# EAGLE design TSOC_USBUART2 (EAGLE 6.6.0)
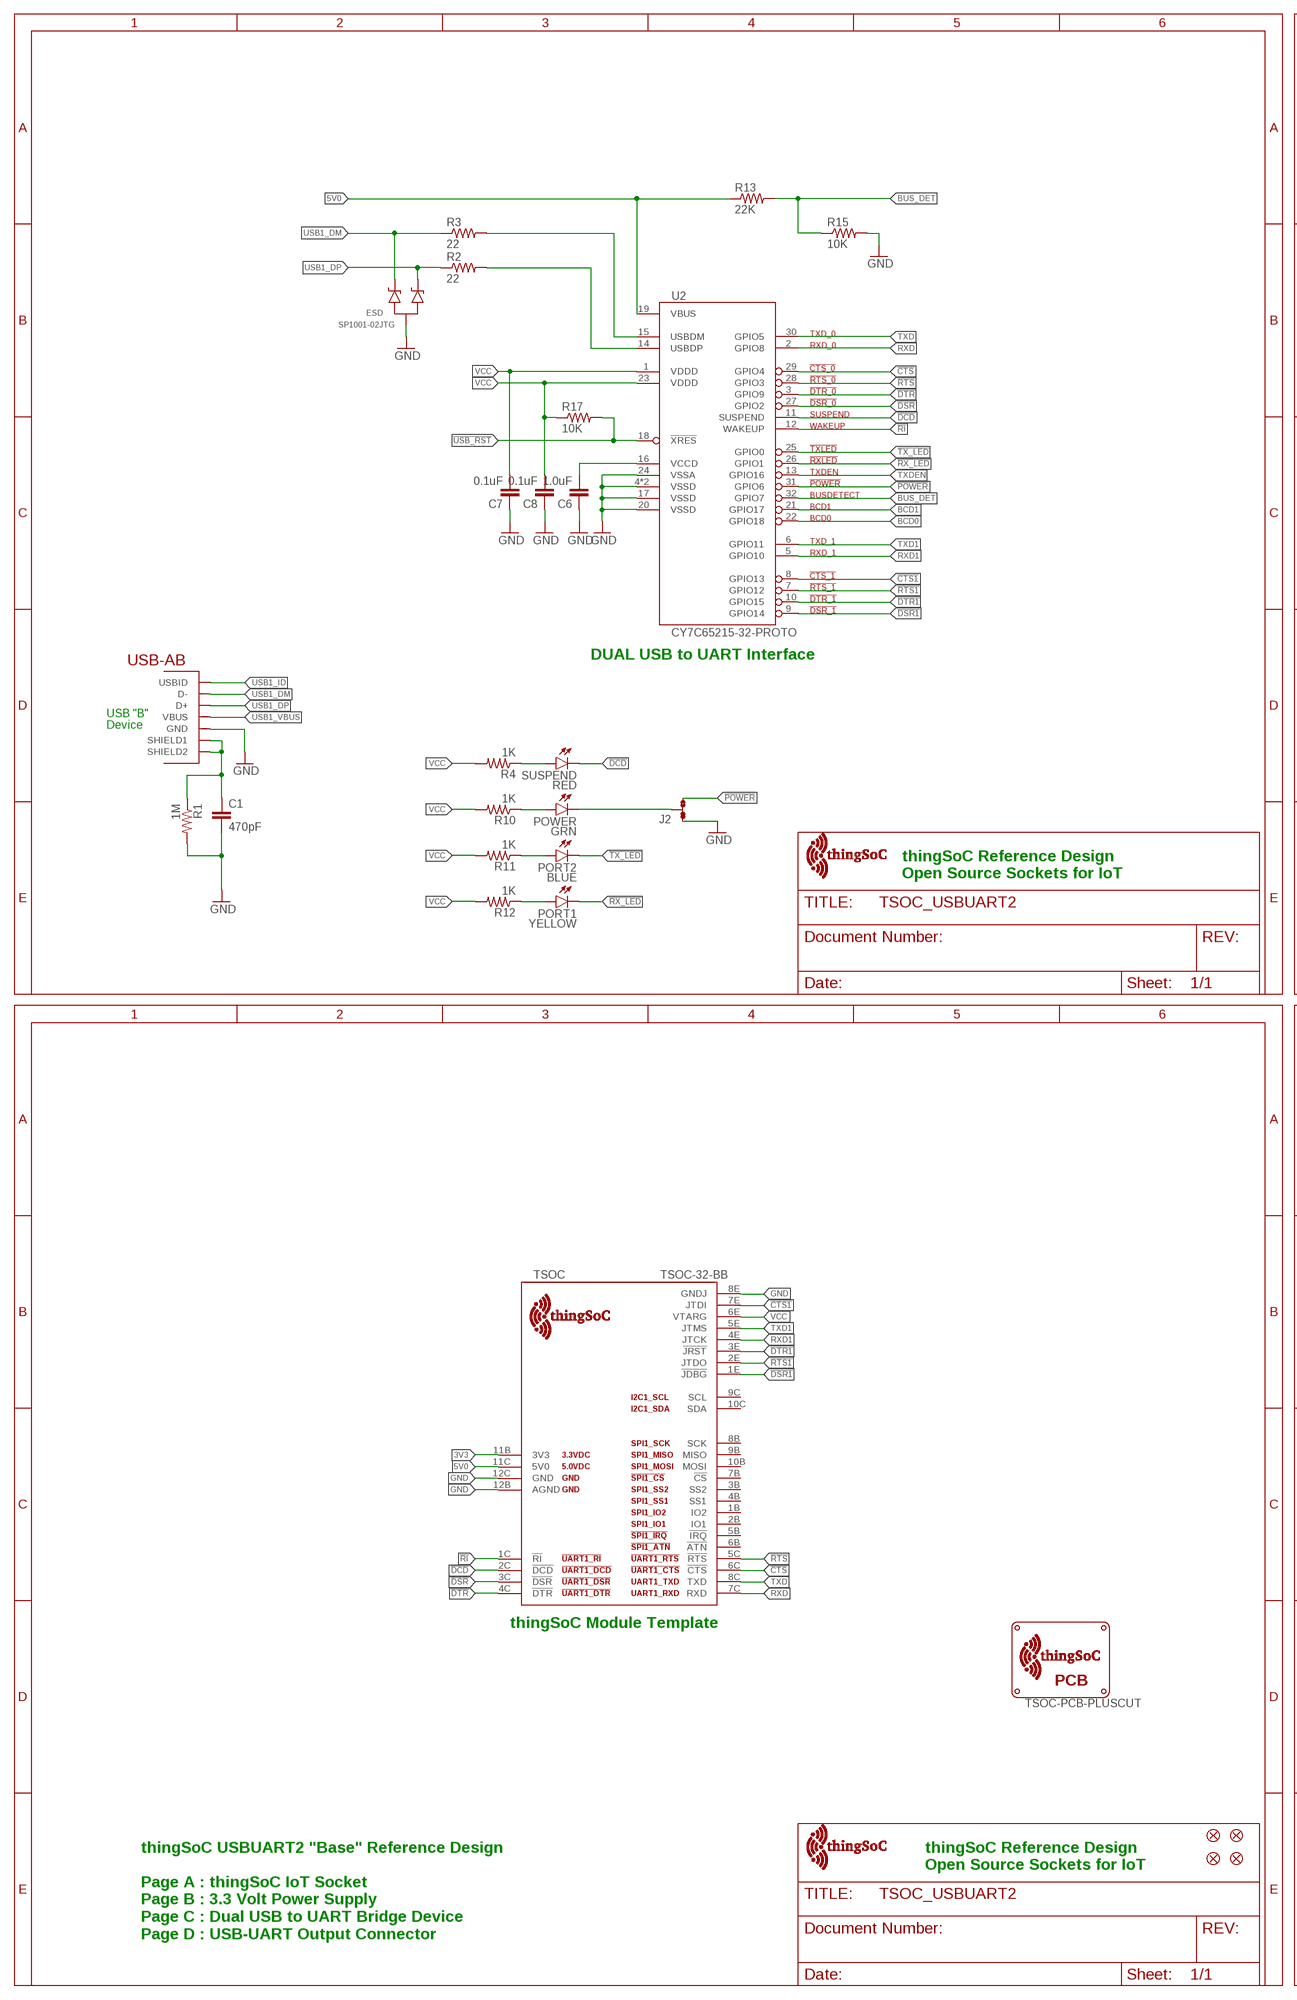
[diagram p0: schematic, sheet 1, part 1 of 2]
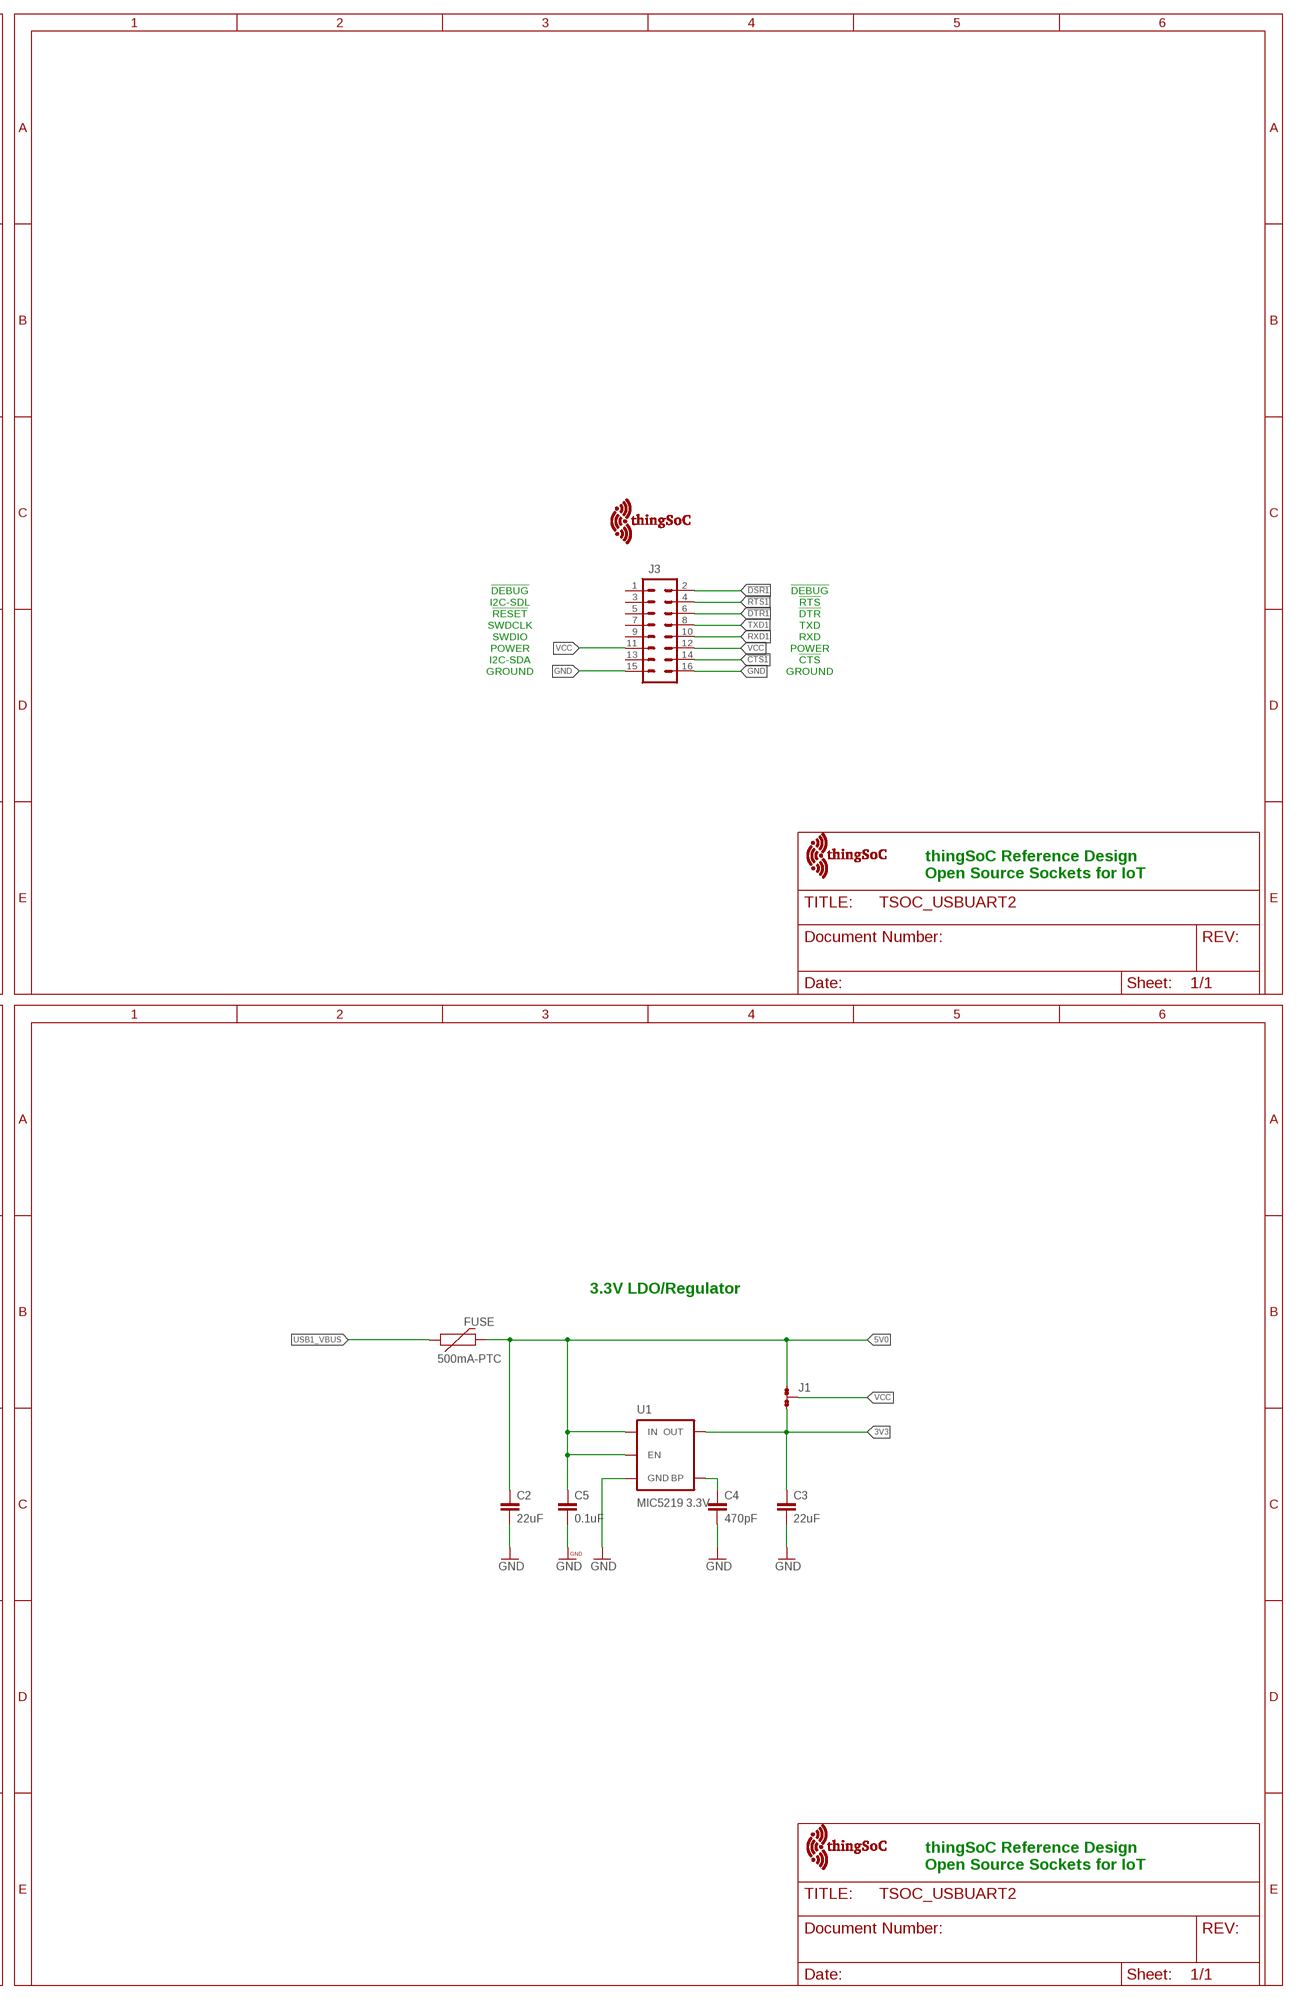
[diagram p1: schematic, sheet 1, part 2 of 2]

## Parts
C1  470pF  CAP-0603  [EIA-0603]
C2  22uF  CAP-1206  [EIA-1206]
C3  22uF  CAP-1206  [EIA-1206]
C4  470pF  CAP-0603  [EIA-0603]
C5  0.1uF  CAP-0603  [EIA-0603]
C6  1.0uF  CAP-0603  [EIA-0603]
C7  0.1uF  CAP-0603  [EIA-0603]
C8  0.1uF  CAP-0603  [EIA-0603]
ESD  SP1001-02JTG  [SC70-3]
FID1  FIDUCIALUFIDUCIAL  [MICRO-FIDUCIAL]
FID2  FIDUCIALUFIDUCIAL  [MICRO-FIDUCIAL]
FID3  FIDUCIALUFIDUCIAL  [MICRO-FIDUCIAL]
FID4  FIDUCIALUFIDUCIAL  [MICRO-FIDUCIAL]
FUSE  500mA-PTC  PTCSMD  [PTC-1206]
J1  JMP-3-1_2  [JMP-3-1_2]
J2  JMP-3-1_2  [JMP-3-1_2]
J3  M08X2  [2X8]
PORT1  YELLOW  LED0603  [LED-0603]
PORT2  BLUE  LED0603  [LED-0603]
POWER  GRN  LED0603  [LED-0603]
R1  1M  RESISTOR-0603  [EIA-0603]
R2  22  RESISTOR-0603  [EIA-0603]
R3  22  RESISTOR-0603  [EIA-0603]
R4  1K  RESISTOR-0603  [EIA-0603]
R10  1K  RESISTOR-0603  [EIA-0603]
R11  1K  RESISTOR-0603  [EIA-0603]
R12  1K  RESISTOR-0603  [EIA-0603]
R13  22K  RESISTOR-0603  [EIA-0603]
R15  10K  RESISTOR-0603  [EIA-0603]
R17  10K  RESISTOR-0603  [EIA-0603]
SUSPEND  RED  LED0603  [LED-0603]
TSOC  TSOC-32-BB  [TSOC-BB-S32]
U1  MIC5219 3.3V  V_REG_MIC52193.3V  [SOT23-5]
U2  CY7C65215-32-PROTO  [QFN32-PROTO]
U$3  TSOC-LOGO-LRG  [TSOC-LOGO-LRG]
U$4  TSOC-LOGO  [TSOC-LOGO-BLANK]
U$5  TSOC-LOGO  [TSOC-LOGO-BLANK]
U$6  TSOC-LOGO  [TSOC-LOGO-BLANK]
U$7  TSOC-PCB-PLUSCUT  [TSOC-BB-BRD-PLUS-CUT]
U$8  TSOC-LOGO-SMALL  [TSOC-LOGO-SML]
USB  USB_AB  [USB-AB-MICRO-SMD]

## Nets
3V3: C3.1 J1.3 TSOC.11B(3V3) U1.5(OUT)
5V0: C2.1 C5.1 FUSE.2 J1.1 R13.1 TSOC.11C(5V0) U1.1(IN) U1.3(EN) U2.19(VBUS)
!CTS: TSOC.6C(!CTS) U2.29(GPIO4)
!CTS1: J3.14 TSOC.7E(JTDI) U2.8(GPIO13)
!DCD: SUSPEND.C TSOC.2C(!DCD) U2.11(SUSPEND)
!DSR: TSOC.3C(!DSR) U2.27(GPIO2)
!DSR1: J3.2 TSOC.1E(!JDBG) U2.9(GPIO14)
!DTR: TSOC.4C(!DTR) U2.3(GPIO9)
!DTR1: J3.6 TSOC.3E(!JRST) U2.10(GPIO15)
!POWER: J2.3 U2.31(GPIO6)
!RI: TSOC.1C(!RI) U2.12(WAKEUP)
!RTS: TSOC.5C(!RTS) U2.28(GPIO3)
!RTS1: J3.4 TSOC.2E(JTDO) U2.7(GPIO12)
!RX_LED: PORT1.C U2.26(GPIO1)
!TX_LED: PORT2.C U2.25(GPIO0)
!USB_RST: R17.2 U2.18(!XRES)
BCD0: U2.22(GPIO18)
BCD1: U2.21(GPIO17)
BLU: PORT2.A R11.1
BUS_DET: R13.2 R15.1 U2.32(GPIO7)
BYPASS1: C4.1 U1.4(BP)
GND [vcc]: C1.2 C2.2 C3.2 C4.2 C5.2 C6.1 C7.1 C8.1 ESD.3(A) J2.1 J3.15 J3.16 R1.2 R15.2 TSOC.8E(GNDJ) TSOC.12B(AGND) TSOC.12C(GND) U1.2(GND) U2.4(VSSD) U2.17(VSSD) U2.20(VSSD) U2.24(VSSA) U2.EXP(VSSD) USB.GND
GRN: POWER.A R10.1
PWR: J2.2 POWER.C
RED: R4.1 SUSPEND.A
RXD: TSOC.7C(RXD) U2.2(GPIO8)
RXD1: J3.10 TSOC.4E(JTCK) U2.5(GPIO10)
TXD: TSOC.8C(TXD) U2.30(GPIO5)
TXD1: J3.8 TSOC.5E(JTMS) U2.6(GPIO11)
TXDEN: U2.13(GPIO16)
USB1_DM: ESD.2(C2) R3.1 USB.D-
USB1_DP: ESD.1(C1) R2.1 USB.D+
USB1_ID: USB.ID(USBID)
USB1_M: R3.2 U2.15(USBDM)
USB1_P: R2.2 U2.14(USBDP)
USB1_SHIELD: C1.1 R1.1 USB.SHIELD1 USB.SHIELD2
USB1_VBUS: FUSE.1 USB.VBUS
VCC: C7.2 C8.2 J1.2 J3.11 J3.12 R4.2 R10.2 R11.2 R12.2 R17.1 TSOC.6E(VTARG) U2.1(VDDD) U2.23(VDDD)
VCCD1: C6.2 U2.16(VCCD)
YEL: PORT1.A R12.1
Unconnected: J3.1 J3.3 J3.5 J3.7 J3.9 J3.13 TSOC.1B(IO2) TSOC.2B(IO1) TSOC.3B(SS2) TSOC.4B(SS1) TSOC.5B(!IRQ) TSOC.6B(!ATN) TSOC.7B(!CS) TSOC.8B(SCK) TSOC.9B(MISO) TSOC.9C(SCL) TSOC.10B(MOSI) TSOC.10C(SDA)

## Notes on the sheet
- !DEBUG | !DEBUG
- I2C-SDL | !RTS
- !RESET | !DTR
- SWDCLK | TXD
- SWDIO | RXD
- POWER | POWER
- DUAL USB to UART Interface | I2C-SDA | !CTS
- GROUND | GROUND
- USB "B"
- Device
- thingSoC Reference Design
  Open Source Sockets for IoT
- thingSoC Reference Design
  Open Source Sockets for IoT
- 3.3V LDO/Regulator
- thingSoC Module Template
- thingSoC Reference Design
  Open Source Sockets for IoT
- thingSoC Reference Design
  Open Source Sockets for IoT
- thingSoC USBUART2 "Base" Reference Design
  
  Page A : thingSoC IoT Socket
  Page B : 3.3 Volt Power Supply
  Page C : Dual USB to UART Bridge Device
  Page D : USB-UART Output Connector

## Library data of the parts
C1-C8 = TSOC_USBUART2:CAP: Ceramic Capacitor SMD
ESD = TSOC-ESP8266-BASE:SP1001-02JTG: Littelfuse SP1001-02JTG TVS Diode Array 8pf 15kV Source: http://www.littelfuse.com/data/en/Product_Catalogs/Littelfuse_TVS_Diode_Array_SPA_Catalog.pdf patternshed.com: created 3/25/2012
FID1-FID4 = TSOC-ESP8266-BASE:FIDUCIAL: Fiducial Alignment Points Various fiducial points for machine vision alignment.
FUSE = SparkFun:PTC: Resettable Fuse PTC Resettable Fuse. Spark Fun Electronics SKU : COM-08357
J1 J2 = PatternAgents-ProtoPads:JMP-3-1_2: Three Terminal Jumper - 1 & 2 Connected Positions 1and 2 are normally connected. PatternAgents ProtoPads Library Schematic and PCB layout libraries for design patterns by PatternAgents. For the CADSoft Eagle CAD program : http://www.cadsoftusa.com/download-eagle/ Source LBR : http://www.patternagents.com Github : https://github.com/PatternAgents License : http://creativecommons.org/licenses/by-sa/4.0/ (Creative Commons 4.0) THIS SOFTWARE IS PROVIDED BY THE CONTRIBUTORS "AS IS" AND WITHOUT ANY EXPRESS OR IMPLIED WARRANTIES, INCLUDING, BUT NOT LIMITED TO, THE IMPLIED WARRANTIES OF MERCHANTABILITY AND FITNESS FOR A PARTICULAR PURPOSE ARE DISCLAIMED. IN NO EVENT SHALL THE COPYRIGHT OWNER OR CONTRIBUTORS BE LIABLE FOR ANY DIRECT, INDIRECT, INCIDENTAL, SPECIAL, EXEMPLARY, OR CONSEQUENTIAL DAMAGES (INCLUDING, BUT NOT LIMITED TO, PROCUREMENT OF SUBSTITUTE GOODS OR SERVICES; LOSS OF USE, DATA, OR PROFITS; OR BUSINESS INTERRUPTION) HOWEVER CAUSED AND ON ANY THEORY OF LIABILITY, WHETHER IN CONTRACT, STRICT LIABILITY, OR TORT (INCLUDING NEGLIGENCE OR OTHERWISE) ARISING IN ANY WAY OUT OF THE USE OF THIS SOFTWARE, EVEN IF ADVISED OF THE POSSIBILITY OF SUCH DAMAGE.; BOM: EXCLUDE
J3 = PatternAgents-ProtoPads:M08X2: .1" headers, two rows of 8 each
PORT1 PORT2 POWER SUSPEND = TSOC-ESP8266-BASE:LED: LEDs Standard schematic elements and footprints for 5mm, 3mm, 1206, and 0603 sized LEDs. 5mm - Spark Fun Electronics SKU : COM-00529 (and others)
R1-R4 R10-R13 R15 R17 = TSOC_USBUART2:RESISTOR
TSOC = thingSoC:TSOC-32: thingSoC Thirty-Two (32) Pin Socket Source LBR : http://www.thingsoc.com Github : https://github.com/thingsoc License : http://creativecommons.org/licenses/by-sa/4.0/ (Creative Commons 4.0) THIS SOFTWARE IS PROVIDED BY THE CONTRIBUTORS "AS IS" AND WITHOUT ANY EXPRESS OR IMPLIED WARRANTIES, INCLUDING, BUT NOT LIMITED TO, THE IMPLIED WARRANTIES OF MERCHANTABILITY AND FITNESS FOR A PARTICULAR PURPOSE ARE DISCLAIMED. IN NO EVENT SHALL THE COPYRIGHT OWNER OR CONTRIBUTORS BE LIABLE FOR ANY DIRECT, INDIRECT, INCIDENTAL, SPECIAL, EXEMPLARY, OR CONSEQUENTIAL DAMAGES (INCLUDING, BUT NOT LIMITED TO, PROCUREMENT OF SUBSTITUTE GOODS OR SERVICES; LOSS OF USE, DATA, OR PROFITS; OR BUSINESS INTERRUPTION) HOWEVER CAUSED AND ON ANY THEORY OF LIABILITY, WHETHER IN CONTRACT, STRICT LIABILITY, OR TORT (INCLUDING NEGLIGENCE OR OTHERWISE) ARISING IN ANY WAY OUT OF THE USE OF THIS SOFTWARE, EVEN IF ADVISED OF THE POSSIBILITY OF SUCH DAMAGE.
U1 = TSOC-ESP8266-BASE:V_REG_MIC5219: V_REG MIC5219 Standard 3.3V and 5V 500mA LDO voltage regulator in SOT-23 layout. Micrel part MIC5219. BP (by-pass) pin is used to lower output noise with 470pF cap, may be left open.; PROD_ID: VREG-09872
U2 = PatternAgents-Cypress:CY7C65215-32: Cypress EZ-USB ® CY7C65215-32QFN DUAL CHANNEL USB TO UART/SPI/IC Bridge Full-Speed USB Peripheral Controller Source Data: http://www.cypress.com/?mpn=CY7C65211-24QFN LBR Source: http://www.patternagents.com THIS SOFTWARE IS PROVIDED BY THE CONTRIBUTORS "AS IS" AND WITHOUT ANY EXPRESS OR IMPLIED WARRANTIES, INCLUDING, BUT NOT LIMITED TO, THE IMPLIED WARRANTIES OF MERCHANTABILITY AND FITNESS FOR A PARTICULAR PURPOSE ARE DISCLAIMED. IN NO EVENT SHALL THE COPYRIGHT OWNER OR CONTRIBUTORS BE LIABLE FOR ANY DIRECT, INDIRECT, INCIDENTAL, SPECIAL, EXEMPLARY, OR CONSEQUENTIAL DAMAGES (INCLUDING, BUT NOT LIMITED TO, PROCUREMENT OF SUBSTITUTE GOODS OR SERVICES; LOSS OF USE, DATA, OR PROFITS; OR BUSINESS INTERRUPTION) HOWEVER CAUSED AND ON ANY THEORY OF LIABILITY, WHETHER IN CONTRACT, STRICT LIABILITY, OR TORT (INCLUDING NEGLIGENCE OR OTHERWISE) ARISING IN ANY WAY OUT OF THE USE OF THIS SOFTWARE, EVEN IF ADVISED OF THE POSSIBILITY OF SUCH DAMAGE.
U$3-U$6 U$8 = thingSoC:TSOC-LOGO: thingSoC Logo Source LBR : http://www.thingsoc.com Github : https://github.com/thingsoc License : http://creativecommons.org/licenses/by-sa/4.0/ (Creative Commons 4.0) THIS SOFTWARE IS PROVIDED BY THE CONTRIBUTORS "AS IS" AND WITHOUT ANY EXPRESS OR IMPLIED WARRANTIES, INCLUDING, BUT NOT LIMITED TO, THE IMPLIED WARRANTIES OF MERCHANTABILITY AND FITNESS FOR A PARTICULAR PURPOSE ARE DISCLAIMED. IN NO EVENT SHALL THE COPYRIGHT OWNER OR CONTRIBUTORS BE LIABLE FOR ANY DIRECT, INDIRECT, INCIDENTAL, SPECIAL, EXEMPLARY, OR CONSEQUENTIAL DAMAGES (INCLUDING, BUT NOT LIMITED TO, PROCUREMENT OF SUBSTITUTE GOODS OR SERVICES; LOSS OF USE, DATA, OR PROFITS; OR BUSINESS INTERRUPTION) HOWEVER CAUSED AND ON ANY THEORY OF LIABILITY, WHETHER IN CONTRACT, STRICT LIABILITY, OR TORT (INCLUDING NEGLIGENCE OR OTHERWISE) ARISING IN ANY WAY OUT OF THE USE OF THIS SOFTWARE, EVEN IF ADVISED OF THE POSSIBILITY OF SUCH DAMAGE.
U$7 = thingSoC:TSOC-PCB: thingSoC PCB Outlines Boards Outlines for Standard Sizes (in the DImension Layer) (Registration marks in the tDocu layer - make sure to turn on tDocu/bDocu) Source LBR : http://www.thingsoc.com Github : https://github.com/thingsoc License : http://creativecommons.org/licenses/by-sa/4.0/ (Creative Commons 4.0) THIS SOFTWARE IS PROVIDED BY THE CONTRIBUTORS "AS IS" AND WITHOUT ANY EXPRESS OR IMPLIED WARRANTIES, INCLUDING, BUT NOT LIMITED TO, THE IMPLIED WARRANTIES OF MERCHANTABILITY AND FITNESS FOR A PARTICULAR PURPOSE ARE DISCLAIMED. IN NO EVENT SHALL THE COPYRIGHT OWNER OR CONTRIBUTORS BE LIABLE FOR ANY DIRECT, INDIRECT, INCIDENTAL, SPECIAL, EXEMPLARY, OR CONSEQUENTIAL DAMAGES (INCLUDING, BUT NOT LIMITED TO, PROCUREMENT OF SUBSTITUTE GOODS OR SERVICES; LOSS OF USE, DATA, OR PROFITS; OR BUSINESS INTERRUPTION) HOWEVER CAUSED AND ON ANY THEORY OF LIABILITY, WHETHER IN CONTRACT, STRICT LIABILITY, OR TORT (INCLUDING NEGLIGENCE OR OTHERWISE) ARISING IN ANY WAY OUT OF THE USE OF THIS SOFTWARE, EVEN IF ADVISED OF THE POSSIBILITY OF SUCH DAMAGE.
USB = BeeSafe:USB_AB: This is a USB AB connector that is compatible with USB OTG. i.e. this connector can serve as a host or device

## Net classes
1 vcc: width 0.254 mm

## Board
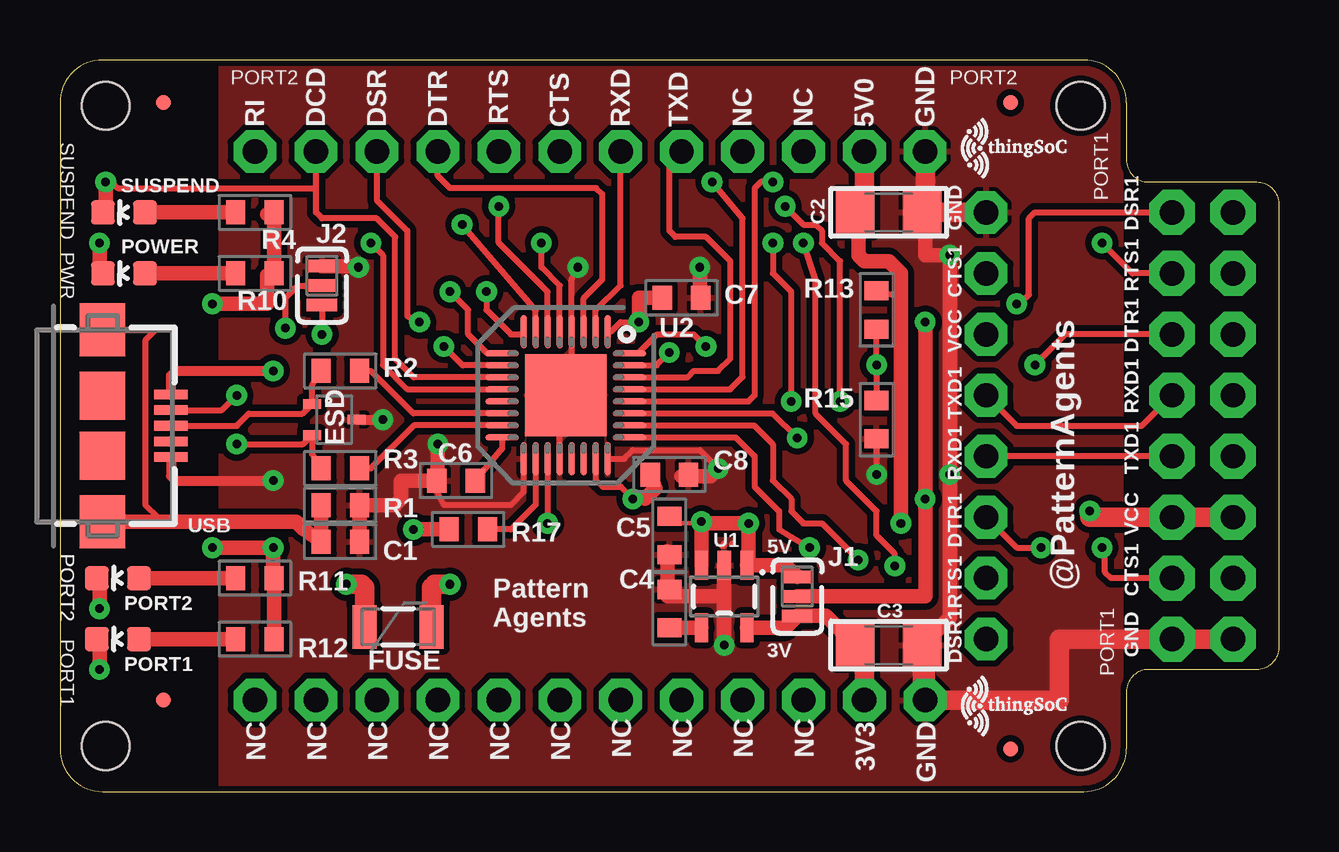
[diagram p2: board, top side]
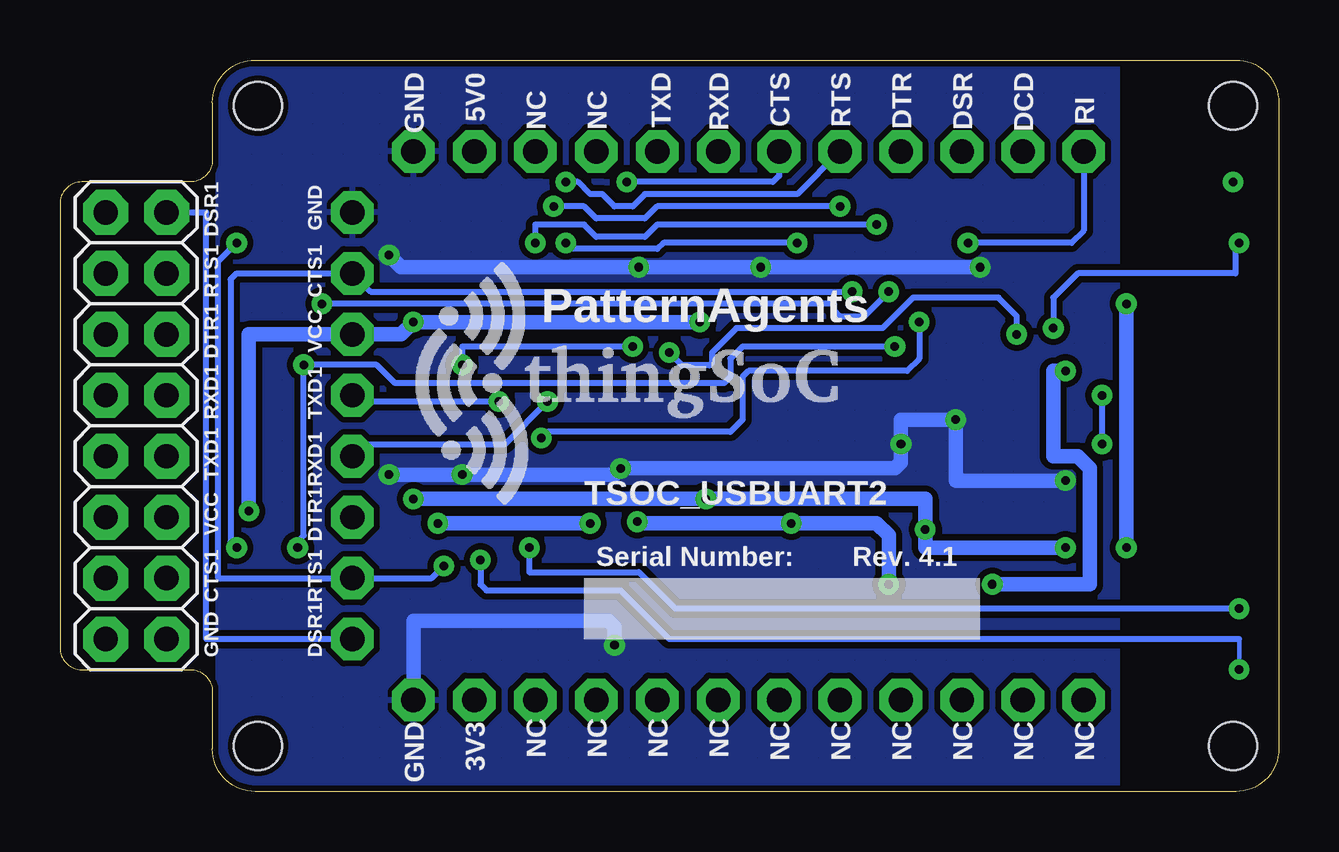
[diagram p3: board, bottom side, seen from below]

Size 50.8 x 30.48 mm. Coordinates in mm from the lower left corner, seen from the top.
Copper layers (1*16): Top 0.035mm / dielectric 1.5mm / Bottom 0.035mm
Design rules "PatternAgents_7mil": minimum track width 7mil, minimum drill 14mil, track to track 7mil, track to pad 7mil, pad to pad 7mil, via to via 7mil, smd to smd 7mil, copper to edge 7mil, drill to drill 7mil, minimum pad ring 12mil, minimum via ring 10mil, stop-mask expansion 4mil, vias tented up to drill 25mil, thermal gap 7mil

### Footprints (pad centres in the part's own frame; a part is rotated, then mirrored left to right if it is on the bottom)
EIA-0603 = smd 0.8 x 1: 1 -0.8,0; 2 0.8,0
EIA-1206 = smd 1.6 x 1.8: 1 -1.4,0; 2 1.4,0
SC70-3 = smd 0.4 x 0.75: 1 -0.65,-0.925; 2 0.65,-0.925; 3 0,0.925
MICRO-FIDUCIAL = smd 0.635 x 0.635: 1 0,0
PTC-1206 = smd 1 x 1.8: 1 -1.4,0; 2 1.4,0
JMP-3-1_2 = smd 0.508 x 1.27: 1 -0.813,0; 2 0,0; 3 0.813,0
2X8 = drill 1.016 pad 1.88 octagon: 1 0,0; 2 0,2.54; 3 2.54,0; 4 2.54,2.54; 5 5.08,0; 6 5.08,2.54; 7 7.62,0; 8 7.62,2.54; 9 10.16,0; 10 10.16,2.54; 11 12.7,0; 12 12.7,2.54; 13 15.24,0; 14 15.24,2.54; 15 17.78,0; 16 17.78,2.54
LED-0603 = smd 1 x 1: A 0,-0.877; C 0,0.877
TSOC-BB-S32 = drill 1.016 pad 1.778 octagon: 1B -11.43,-11.43; 1C -11.43,11.43; 1E 19.05,-8.89; 2B -8.89,-11.43; 2C -8.89,11.43; 2E 19.05,-6.35; 3B -6.35,-11.43; 3C -6.35,11.43; 3E 19.05,-3.81; 4B -3.81,-11.43; 4C -3.81,11.43; 4E 19.05,-1.27; 5B -1.27,-11.43; 5C -1.27,11.43; 5E 19.05,1.27; 6B 1.27,-11.43; 6C 1.27,11.43; 6E 19.05,3.81; 7B 3.81,-11.43; 7C 3.81,11.43; 7E 19.05,6.35; 8B 6.35,-11.43; 8C 6.35,11.43; 8E 19.05,8.89; 9B 8.89,-11.43; 9C 8.89,11.43; 10B 11.43,-11.43; 10C 11.43,11.43; 11B 13.97,-11.43; 11C 13.97,11.43; 12B 16.51,-11.43; 12C 16.51,11.43
SOT23-5 = smd 0.55 x 1.2: 1 -0.95,-1.3; 2 0,-1.3; 3 0.95,-1.3; 4 0.95,1.3; 5 -0.95,1.3
QFN32-PROTO = smd 1.4 x 0.254: 1 -2.65,1.75; 2 -2.65,1.25; 3 -2.65,0.75; 4 -2.65,0.25; 5 -2.65,-0.25; 6 -2.65,-0.75; 7 -2.65,-1.25; 8 -2.65,-1.75; 17 2.65,-1.75; 18 2.65,-1.25; 19 2.65,-0.75; 20 2.65,-0.25; 21 2.65,0.25; 22 2.65,0.75; 23 2.65,1.25; 24 2.65,1.75 | smd 0.254 x 1.4: 9 -1.75,-2.65; 10 -1.25,-2.65; 11 -0.75,-2.65; 12 -0.25,-2.65; 13 0.25,-2.65; 14 0.75,-2.65; 15 1.25,-2.65; 16 1.75,-2.65; 25 1.75,2.65; 26 1.25,2.65; 27 0.75,2.65; 28 0.25,2.65; 29 -0.25,2.65; 30 -0.75,2.65; 31 -1.25,2.65; 32 -1.75,2.65 | smd 3.4 x 3.4: EXP 0,0
TSOC-BB-BRD-PLUS-CUT = hole 2: -13.335,-23.749; 13.335,-23.749; -13.335,16.891; 13.335,16.891
USB-AB-MICRO-SMD = smd 1.4 x 0.4: D+ 2.85,0; D- 2.85,0.65; GND 2.85,-1.3; ID 2.85,-0.65; VBUS 2.85,1.3 | smd 1.9 x 2: P$6 0,1.25; P$7 0,-1.25 | smd 1.9 x 2.2: SHIELD1 0,4; SHIELD2 0,-4

### Placement (x,y rotation side)
C1  11.68,10.41 0 top
C2  34.54,24.13 0 top
C3  34.54,6.1 0 top
C4  25.4,7.62 90 top
C5  25.4,10.67 270 top
C6  16.51,12.95 0 top
C7  25.91,20.57 180 top
C8  25.4,13.21 180 top
ESD  11.43,15.49 270 top
FID1  4.32,28.7 0 top
FID2  4.32,3.81 0 top
FID3  39.62,1.78 0 top
FID4  39.62,28.7 0 top
FUSE  14.1,6.86 0 top
J1  30.73,8.13 270 top
J2  10.92,21.08 270 top
J3  48.89,24.13 270 bottom
PORT1  2.41,6.35 90 top
PORT2  2.41,8.89 90 top
POWER  2.67,21.59 90 top
R1  11.68,11.94 0 top
R2  11.68,17.53 0 top
R3  11.68,13.46 0 top
R4  8.13,24.13 0 top
R10  8.13,21.59 0 top
R11  8.13,8.89 0 top
R12  8.13,6.35 0 top
R13  34.04,20.07 270 top
R15  34.04,15.49 270 top
R17  17.02,10.92 0 top
SUSPEND  2.67,24.13 90 top
TSOC  19.56,15.24 0 top
U1  27.69,8.13 180 top
U2  21.08,16.51 270 top
U$1  TSOC-LOGO-SMALL  [TSOC-LOGO-SML]  38.35,3.56 0 top
U$3  32.77,17.02 0 bottom
U$4  4.32,1.78 0 top
U$5  4.32,1.78 0 top
U$6  4.32,1.78 0 top
U$7  25.65,15.24 270 top
U$8  38.35,26.8 0 top
USB  1.78,15.24 0 top

### Tracks (layer width: path | path; a pad name or v marks a point on that pad's centre or on a via)
3V3
  Top 0.61: U1.5 30.25,6.83 J1.3 31.93,7.32 C3.1
  Top 0.813: TSOC.11B 33.53,5.71 C3.1
5V0  (via drill 0.36)
  Top 0.178: C5.1 25.4,11.18 26.42,11.18 v26.74,11.24
  Top 0.254: R13.1 34.98,20.65 35.05,20.57 | U2.19 20.33,12.46 v20.32,11.18
  Top 0.61: J1.1 30.25,9.43 U1.1 28.7,9.49 v28.7,11.18 26.67,11.18 v26.74,11.24 | v26.74,11.24 U1.3 | v35.05,11.18 35.05,20.57 35.05,21.59 34.54,22.1 33.53,22.1 33.27,22.35 33.27,24 C2.1 33.25,24.24 33.53,24.24 | v26.73,11.25 v26.74,11.24
  Top 0.813: 33.53,24.24 TSOC.11C | FUSE.2 15.5,8.51 15.62,8.64 v16.26,8.64
  Bottom 0.61: v28.7,11.18 v35.05,11.18 | v26.74,11.24 26.67,11.18 v20.32,11.18 16.76,11.18 16.26,10.67 v16.26,8.64
!CTS  (via drill 0.36)
  Top 0.254: U2.29 27.94,16.76 28.45,17.27 28.45,23.88 v27.18,25.4
  Bottom 0.254: TSOC.6C 20.83,25.65 21.08,25.4 v27.18,25.4
!CTS1  (via drill 0.36)
  Top 0.254: v17.78,20.83 17.78,20.07 18.8,19.05 19.22,19.05 U2.8 | J3.14 43.81,8.89 43.56,9.14 43.56,10.03 v43.43,10.16
  Bottom 0.254: v43.43,10.16 43.69,10.41 43.69,21.34 43.43,21.59 TSOC.7E 37.85,20.83 v17.78,20.83
!DCD  (via drill 0.36)
  Top 0.254: v1.9,25.4 2.16,25.4 2.41,25.15 10.67,25.15 | 10.67,25.15 TSOC.2C | U2.11 14.74,17.26 13.97,18.03 13.97,23.11 13.21,23.88 10.92,23.88 10.67,24.13 10.67,25.15
  Top 0.61: SUSPEND.C 1.9,24.13 v1.9,25.4
!DSR  (via drill 0.36)
  Top 0.254: TSOC.3C 13.21,24.64 14.48,23.37 14.48,19.81 v14.99,19.56 | v30.73,14.73 29.71,15.76 U2.27
  Bottom 0.254: v14.99,19.56 14.99,18.03 15.49,17.53 22.1,17.53 22.35,17.27 22.35,15.49 22.86,14.99 30.48,14.99 v30.73,14.73
!DSR1  (via drill 0.36)
  Top 0.254: U2.9 17.81,18.26 17.02,19.05 17.02,20.07 v16.26,20.83 | v39.88,20.32 40,20.32 40.39,20.7 40.39,23.88 40.64,24.13 J3.2
  Bottom 0.254: TSOC.1E 44.7,6.35 44.7,24.13 J3.2 | v39.88,20.32 18.54,20.32 18.54,20.07 18.29,19.81 17.27,19.81 v16.26,20.83
!DTR
  Top 0.254: TSOC.4C 15.75,25.65 16.26,25.15 22.35,25.15 22.61,24.89 22.61,21.34 21.83,20.56 U2.3
!DTR1  (via drill 0.36)
  Top 0.254: TSOC.3E 39.88,10.16 v40.89,10.16 | U2.10 16.78,17.76 v16,18.54 | J3.6 41.91,19.05 v40.64,17.78
  Bottom 0.254: v40.89,10.16 40.89,10.41 40.64,10.67 v40.64,17.78 37.59,17.78 36.83,17.02 23.11,17.02 22.86,17.27 22.86,18.03 22.35,18.54 v16,18.54
!POWER  (via drill 0.36)
  Top 0.254: J2.3 v10.92,19.05 | U2.31 24.87,17.76 v25.4,18.29
  Bottom 0.254: v10.92,19.05 10.92,19.81 11.68,20.57 15.24,20.57 16.51,19.3 22.61,19.3 23.62,18.29 23.62,17.87 U2.31 24.87,17.76 v25.4,18.29
!RI  (via drill 0.36)
  Top 0.254: U2.12 14.48,16.76 13.46,17.78 13.46,22.35 v12.95,22.86
  Bottom 0.254: TSOC.1C 8.13,23.37 8.64,22.86 v12.95,22.86
!RTS  (via drill 0.36)
  Top 0.254: U2.28 28.7,16.26 28.96,16.51 28.96,25.15 29.21,25.4 v29.72,25.4
  Bottom 0.254: TSOC.5C 20.07,24.89 26.42,24.89 26.92,24.38 27.69,24.38 28.19,24.89 28.7,24.89 29.21,25.4 v29.72,25.4
!RTS1  (via drill 0.36)
  Top 0.254: U2.7 19.83,20.05 v16.76,23.62 | v34.8,9.4 34.8,9.91 34.04,10.67 34.04,11.68 32.77,12.95 32.77,14.48 31.5,15.75 31.5,21.34 v30.99,22.86 | J3.4 44.7,21.59 v43.43,22.86
  Bottom 0.254: v43.43,22.86 44.2,22.1 44.2,8.89 TSOC.2E 35.31,8.89 v34.8,9.4 | v16.76,23.62 25.91,23.62 26.42,23.11 28.45,23.11 28.96,23.62 30.99,23.62 v30.99,22.86
!RX_LED  (via drill 0.36)
  Top 0.254: U2.26 28.94,15.26 29.72,14.48 29.72,12.95 30.48,12.19 30.48,11.68 30.99,11.18 31.75,11.18 v33.27,9.65
  Top 0.61: PORT1.C 1.65,6.35 v1.65,5.08
  Bottom 0.178: v1.65,5.08 1.65,6.35
  Bottom 0.254: 1.65,6.35 25.4,6.35 27.43,8.38 33.02,8.38 33.27,8.64 v33.27,9.65
!TX_LED  (via drill 0.36)
  Top 0.254: U2.25 28.17,14.76 28.96,13.97 28.96,12.7 29.97,11.68 29.97,10.92 v31.24,10.16
  Top 0.61: PORT2.C 1.65,8.89 v1.65,7.62
  Bottom 0.254: v1.65,7.62 25.15,7.62 26.67,9.14 31.24,9.14 v31.24,10.16
!USB_RST
  Top 0.254: U2.18 19.83,11.96 18.8,10.92 R17.2
BLU
  Top 0.61: R11.1 PORT2.A
BUS_DET  (via drill 0.36)
  Top 0.254: R13.2 v34.04,17.78 R15.1 | U2.32 24.1,18.26 24.89,19.05 26.42,19.05 v26.92,18.54
  Bottom 0.254: v26.92,18.54 34.04,18.54 v34.04,17.78
BYPASS1
  Top 0.61: U1.4 25.61,6.83 C4.1
GND  (via drill 0.36)
  Top 0.254: v21.59,21.84 21.33,21.34 U2.4 21.33,16.76 U2.EXP 20.83,16.26 U2.20 | 25.91,13.28 C8.1 | U2.24 23.51,13.86 23.88,14.22 26.67,14.22 v27.43,13.46 | R15.2 v34.04,13.21 | 15.75,13.03 C6.1 15.75,13.17 15.75,12.45 16,11.94 18.8,11.94 19.33,12.47 U2.17 | U1.2 27.61,9.53 27.79,9.53 U1.2 | 27.61,10.24 27.7,10.24 | U1.2 27.61,9.35 27.7,9.44 27.66,9.42 U1.2 | 36.02,5.51 C3.2 | C3.2 35.84,6.04 35.82,5.97 | C3.2 36.02,6.04 36.02,5.97 | 36.02,5.69 C3.2 | 36.02,5.87 C3.2 | 36.37,5.87 36.37,4.27 36.19,4.09 | 36.19,4.27 TSOC.12B | 36.19,4.27 | 36.19,4.09 TSOC.12B | 36.19,4.09 | 37.11,7.64 37.08,7.62 | 35.84,5.16 35.94,5.16 | 36.02,4.8 35.94,4.8 | 36.02,4.09 TSOC.12B | TSOC.12B 35.84,4.09 35.94,4.09 | 28.02,10.31 28.02,10.33 | U1.2 27.66,9.6 27.7,9.6 | 27.66,10.31 27.7,10.33
  Top 0.406: ESD.3 v13.46,15.49 | USB.GND 4.63,13.15 4.83,12.95 v8.89,12.95
  Top 0.61: C1.2 R1.2 13.97,11.94 14.22,12.19 14.22,12.95 C6.1 15.75,13.25 v15.75,14.48 | C8.1 25.91,13.14 27.11,13.14 v27.43,13.46 | C5.2 25.33,10.02 25.33,8.13 C4.2 25.47,8.13 27.69,8.13 | J2.1 12.39,21.89 v12.45,21.84 | U1.2 27.69,8.13 | 27.69,8.13 v27.69,6.1 | C7.1 26.67,20.57 v26.67,21.84 | C2.2 36.07,24.01 36.07,22.35 v37.08,22.35 v37.08,13.21 37.08,7.62 37.08,7.24 C3.2
  Top 0.813: TSOC.12B 41.66,3.81 41.66,6.35 J3.16 J3.15 | 36.04,3.83 TSOC.12B | TSOC.12C 36.07,24.13 TSOC.8E | C3.2 35.94,5.16 35.94,4.8 35.94,3.93 TSOC.12B
  Bottom 0.61: v37.08,13.21 v34.04,13.21 27.69,13.21 v27.43,13.46 16,13.46 15.75,13.72 v15.75,14.48 15.75,15.49 v13.46,15.49 13.46,12.95 v8.89,12.95 | v37.08,22.35 36.58,21.84 v26.67,21.84 v21.59,21.84 v12.45,21.84 | TSOC.12B 36.07,7.11 27.94,7.11 27.69,6.86 v27.69,6.1
  pour Top (isolate 0.254, hatched): 6.73,30.48 42.39,30.48 arc-90 44.2,28.67 44.2,1.81 arc-90 42.39,0 6.73,0
  pour Bottom (isolate 0.254, hatched): 6.73,30.48 42.4,30.48 arc-90 44.2,28.68 44.2,1.81 arc-90 42.39,0 6.73,0
GRN
  Top 0.61: R10.1 POWER.A
PWR  (via drill 0.36)
  Top 0.254: v9.4,19.3 9.4,20.57 9.91,21.08 J2.2
  Top 0.61: v1.65,22.86 1.65,21.73 POWER.C
  Bottom 0.254: v1.65,22.86 1.79,22.72 POWER.C 8.38,21.59 9.4,20.57 v9.4,19.3
RED
  Top 0.61: R4.1 SUSPEND.A
RXD
  Top 0.254: U2.2 22.33,20.05 23.37,21.08 TSOC.7C
RXD1  (via drill 0.36)
  Top 0.254: U2.5 20.83,21.08 20.07,21.84 v20.07,22.86 | v30.48,16.26 30.48,20.83 29.72,21.59 v29.72,22.86 | J3.10 TSOC.4E
  Bottom 0.254: TSOC.4E 38.1,14.48 32.26,14.48 v30.48,16.26 | v20.07,22.86 25.65,22.86 25.91,22.61 29.72,22.61 v29.72,22.86
TXD
  Top 0.254: U2.30 26.15,17.26 26.42,17.53 27.43,17.53 27.94,18.03 27.94,22.1 26.92,23.11 25.65,23.11 25.4,23.37 25.4,26.16 TSOC.8C
TXD1  (via drill 0.36)
  Top 0.254: TSOC.5E 39.88,15.24 45.08,15.24 J3.8 | v32.51,16.26 32.51,22.1 31.75,22.86 31.75,23.37 31.5,23.62 30.99,23.62 v30.23,24.38 | U2.6 20.33,20.82 18.29,22.86 v18.29,24.38
  Bottom 0.254: TSOC.5E 38.35,16.26 v32.51,16.26 | v18.29,24.38 25.91,24.38 26.42,23.88 28.45,23.88 28.96,24.38 v30.23,24.38
USB1_DM  (via drill 0.36)
  Top 0.254: ESD.2 10.5,14.06 R3.1 | USB.D- 6.75,15.89 v7.37,16.51 | 10.39,14.73 ESD.2 | v7.37,14.48 10.14,14.48 ESD.2
  Bottom 0.254: v7.37,16.51 v7.37,14.48
USB1_DP
  Top 0.254: ESD.1 10.5,16.93 R2.1 | 10.62,16.26 ESD.1 | USB.D+ 7.37,15.24 7.87,15.75 10.11,15.75 ESD.1
USB1_M
  Top 0.254: U2.15 14.75,15.26 12.95,13.46 R3.2
USB1_P
  Top 0.254: U2.14 14.72,15.76 12.95,17.53 R2.2
USB1_SHIELD
  Top 0.254: USB.SHIELD1 4,19.24 3.56,18.8 3.56,11.94 4.06,11.43 4.89,11.43 USB.SHIELD2
  Top 0.61: USB.SHIELD2 9.84,11.24 10.16,10.92 C1.1 R1.1
USB1_VBUS  (via drill 0.36)
  Top 0.406: USB.VBUS 4.63,17.33 4.83,17.53 v8.89,17.53
  Top 0.813: FUSE.1 12.7,8.51 12.57,8.64 v11.94,8.64
  Bottom 0.61: v11.94,8.64 7.87,8.64 7.87,13.46 8.38,13.97 9.4,13.97 9.4,17.53 v8.89,17.53
VCC  (via drill 0.36)
  Top 0.178: v23.88,12.19 24.38,12.19
  Top 0.254: U2.1 22.97,19.16 23.37,19.56 v24.13,19.56 | U2.23 22.33,12.97 22.61,12.7 23.37,12.7 v23.88,12.19
  Top 0.61: 8.64,24.06 R4.2 R10.2 8.64,21.52 8.64,20.32 v6.35,20.32 | R12.2 R11.2 8.89,8.93 v8.89,10.16 v6.35,10.16 | v36.07,19.56 v36.07,12.19 36.07,8.13 J1.2 | C8.2 24.82,12.63 24.38,12.19 | C7.2 24.13,20.57 v24.13,19.56 | R17.1 v14.73,10.92
  Top 0.813: J3.11 J3.12 42.93,11.43 v42.93,11.68
  Bottom 0.61: v42.93,11.68 42.93,19.05 TSOC.6E 36.58,19.05 v36.07,19.56 v24.13,19.56 | v36.07,12.19 v23.88,12.19 14.73,12.19 v14.73,10.92 14.73,10.16 v8.89,10.16 | v6.35,10.16 v6.35,20.32
VCCD1
  Top 0.254: U2.16 18.43,14.3 C6.2
YEL
  Top 0.61: R12.1 PORT1.A

### Text on the board
tPlace: PORT2 | PORT2 | RI | DCD | DSR | DTR | RTS | CTS | RXD | TXD | NC | NC | 5V0 | GND | SUSPEND | PORT1 | GND | DSR1 | PWR | CTS1 | RTS1 | VCC | DTR1 | RXD1 | TXD1 | RXD1 | TXD1 | VCC | PORT2 | PORT2 | 5V | DTR1 | RTS1 | @PatternAgents | CTS1 | Pattern / Agents | PORT1 | 3V | GND | DSR1 | PORT1 | NC | NC | NC | NC | NC | NC | NC | NC | NC | NC | 3V3 | GND
bPlace: DCD | DSR | DTR | RTS | CTS | RXD | TXD | 5V0 | GND | RI | NC | NC | GND | DSR1 | CTS1 | RTS1 | PatternAgents | VCC | DTR1 | TXD1 | RXD1 | RXD1 | TXD1 | TSOC_USBUART2 | VCC | DTR1 | Rev. 4.1 | Serial Number: | RTS1 | CTS1 | DSR1 | GND | NC | NC | NC | NC | NC | NC | NC | NC | NC | NC | 3V3 | GND